# EAGLE design SchematicControlMotor (EAGLE 9.6.2)
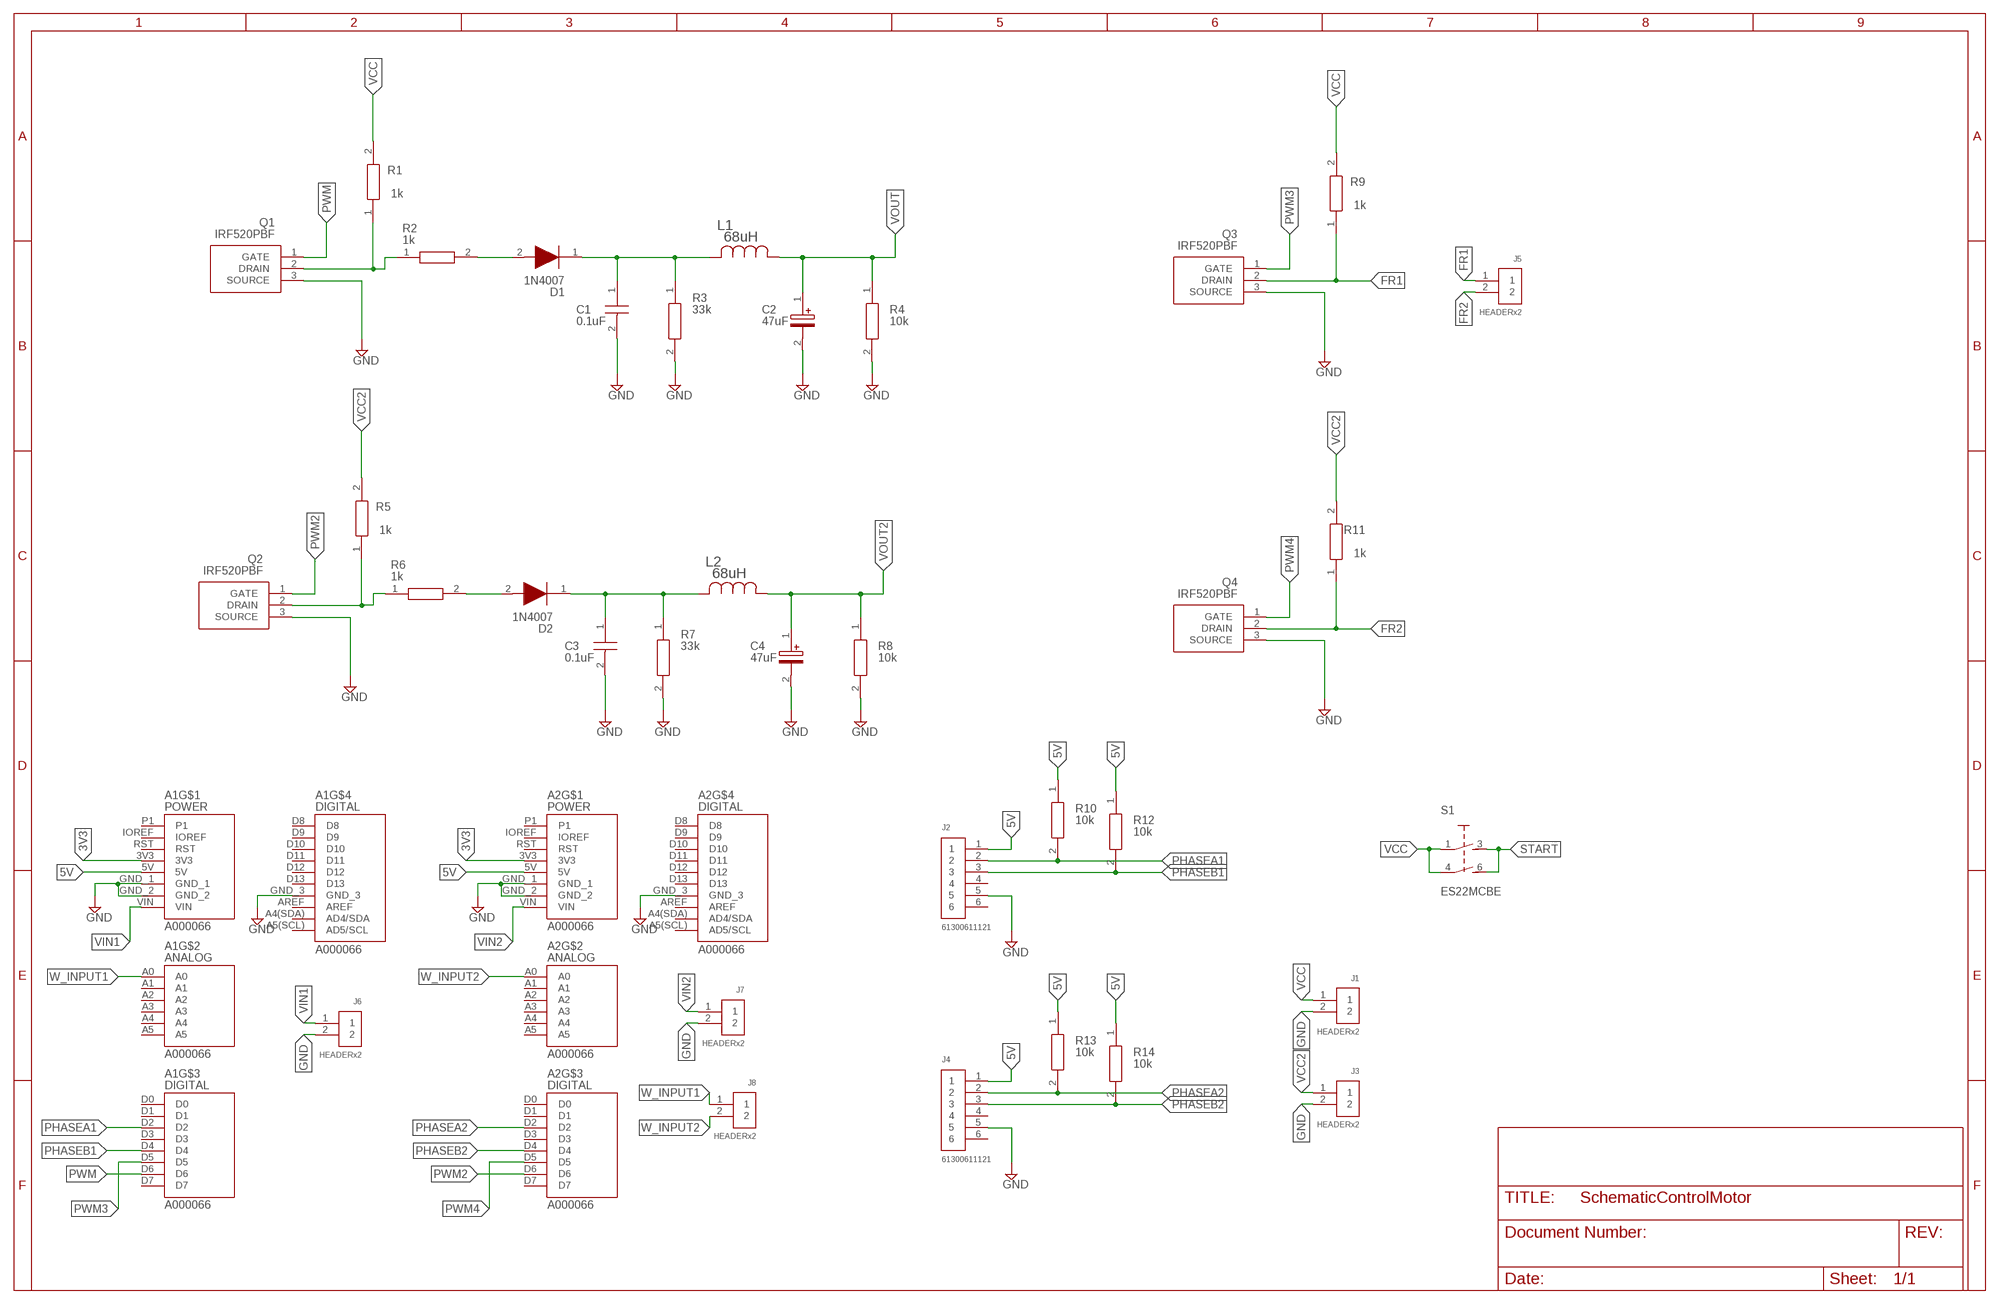
[diagram p0: schematic, sheet 1]

## Parts
A1  A000066  [ARDUINO_A000066]
A2  A000066  [ARDUINO_A000066]
C1  0.1uF  CAPACITOR0.1U  [K104K10X7RF5TL2]
C2  47uF  CAPACITOR10U  [CAPPRD200W50D525H1100]
C3  0.1uF  CAPACITOR0.1U  [K104K10X7RF5TL2]
C4  47uF  CAPACITOR10U  [CAPPRD200W50D525H1100]
D1  1N4007  [DIOAD1405W58L465D235]
D2  1N4007  [DIOAD1405W58L465D235]
J1  HEADERx2  61300211121  [61300211121]
J2  61300611121  [61300611121]
J3  HEADERx2  61300211121  [61300211121]
J4  61300611121  [61300611121]
J5  HEADERx2  61300211121  [61300211121]
J6  HEADERx2  61300211121  [61300211121]
J7  HEADERx2  61300211121  [61300211121]
J8  HEADERx2  61300211121  [61300211121]
L1  68uH  INDUCTOR68U  [IND_BOURNS_78F]
L2  68uH  INDUCTOR68U  [IND_BOURNS_78F]
Q1  IRF520PBF  [TO254P465X1024X2050-3P]
Q2  IRF520PBF  [TO254P465X1024X2050-3P]
Q3  IRF520PBF  [TO254P465X1024X2050-3P]
Q4  IRF520PBF  [TO254P465X1024X2050-3P]
R1  1k  RESISTOR  [RESAD1041W46L381D165]
R2  1k  RESISTOR  [RESAD1041W46L381D165]
R3  33k  RESISTOR  [RESAD1041W46L381D165]
R4  10k  RESISTOR  [RESAD1041W46L381D165]
R5  1k  RESISTOR  [RESAD1041W46L381D165]
R6  1k  RESISTOR  [RESAD1041W46L381D165]
R7  33k  RESISTOR  [RESAD1041W46L381D165]
R8  10k  RESISTOR  [RESAD1041W46L381D165]
R9  1k  RESISTOR  [RESAD1041W46L381D165]
R10  10k  RESISTOR  [RESAD1041W46L381D165]
R11  1k  RESISTOR  [RESAD1041W46L381D165]
R12  10k  RESISTOR  [RESAD1041W46L381D165]
R13  10k  RESISTOR  [RESAD1041W46L381D165]
R14  10k  RESISTOR  [RESAD1041W46L381D165]
S1  ES22MCBE  [ES22MCBE]

## Nets
3V3: A1.3V3 A2.3V3
5V: A1.5V A2.5V J2.1 J4.1 R10.1 R12.1 R13.1 R14.1
FR1: J5.1 Q3.2(DRAIN) R9.1
FR2: J5.2 Q4.2(DRAIN) R11.1
GND: A1.GND_1 A1.GND_2 A1.GND_3 A2.GND_1 A2.GND_2 A2.GND_3 C1.2 C2.2(-) C3.2 C4.2(-) J1.2 J2.5 J3.2 J4.5 J6.2 J7.2 Q1.3(SOURCE) Q2.3(SOURCE) Q3.3(SOURCE) Q4.3(SOURCE) R3.2 R4.2 R7.2 R8.2
N$1: Q1.2(DRAIN) R1.1 R2.1
N$2: D1.2(A) R2.2
N$3: C1.1 D1.1(K) L1.2 R3.1
N$4: D2.2(A) R6.2
N$5: C3.1 D2.1(K) L2.2 R7.1
N$6: Q2.2(DRAIN) R5.1 R6.1
PHASEA1: A1.D2 J2.2 R10.2
PHASEA2: A2.D2 J4.2 R13.2
PHASEB1: A1.D4 J2.3 R12.2
PHASEB2: A2.D4 J4.3 R14.2
PWM: A1.D6 Q1.1(GATE)
PWM2: A2.D6 Q2.1(GATE)
PWM3: A1.D5 Q3.1(GATE)
PWM4: A2.D5 Q4.1(GATE)
START: S1.3 S1.6
VCC: J1.1 R1.2 R9.2 S1.1 S1.4
VCC2: J3.1 R5.2 R11.2
VIN1: A1.VIN J6.1
VIN2: A2.VIN J7.1
VOUT: C2.1(+) L1.1 R4.1
VOUT2: C4.1(+) L2.1 R8.1
W_INPUT1: A1.A0 J8.1
W_INPUT2: A2.A0 J8.2
Unconnected: A1.A1 A1.A2 A1.A3 A1.A4 A1.A4(SDA)(AD4/SDA) A1.A5 A1.A5(SCL)(AD5/SCL) A1.AREF A1.D0 A1.D1 A1.D3 A1.D7 A1.D8 A1.D9 A1.D10 A1.D11 A1.D12 A1.D13 A1.IOREF A1.P1 A1.RST A2.A1 A2.A2 A2.A3 A2.A4 A2.A4(SDA)(AD4/SDA) A2.A5 A2.A5(SCL)(AD5/SCL) A2.AREF A2.D0 A2.D1 A2.D3 A2.D7 A2.D8 A2.D9 A2.D10 A2.D11 A2.D12 A2.D13 A2.IOREF A2.P1 A2.RST J2.4 J2.6 J4.4 J4.6

## Library data of the parts
A1 A2 = DisenoElectronico:A000066: Microcontroller board, Uno [Arduino] A000066 Microcontroller board, Uno 7640152110092 Check prices <https://pricing.snapeda.com/parts/A000066/Arduino/view-part?ref=eda> Check prices <https://pricing.snapeda.com/parts/A000066/Arduino/view-part?ref=eda> Check availability <https://pricing.snapeda.com/parts/ARDUINO%20UNO%20REV3/Arduino/view-part?ref=eda>; AVAILABILITY: Not in stock; DESCRIPTION: Microcontroller board based on the ATmega328P.; MF: Arduino; MP: ARDUINO UNO REV3; PACKAGE: Non-Standard Arduino; PRICE: None
C1 C3 = HardwareRobotica:CAPACITOR0.1U: Cap Ceramic 0.1uF 50V X7R 10% Radial 2.5mm 125C T/R Source: Datasheet <https://www.vishay.com/docs/45171/kseries.pdf>; DESCRIPTION: Cap Ceramic 0.1uF 50V X7R 10% Radial 2.5mm 125C T/R; HEIGHT: 5.2mm; MANUFACTURER_NAME: Vishay; MANUFACTURER_PART_NUMBER: K104K10X7RF5TL2; MOUSER_PART_NUMBER: 594-K104K10X7RF5TL2; MOUSER_PRICE-STOCK: https://www.mouser.co.uk/ProductDetail/Vishay-BC-Components/K104K10X7RF5TL2?qs=B4Lc6Tv24tbCh1UvC16VNg%3D%3D
C2 C4 = HardwareRobotica:CAPACITOR10U: CORNELL DUBILIER - SEK100M050ST - ALUMINUM ELECTROLYTIC CAPACITOR 10UF, 50V, 20%, RADIAL Source: Datasheet <https://componentsearchengine.com/Datasheets/2/SEK100M050ST.pdf>; DESCRIPTION: CORNELL DUBILIER - SEK100M050ST - ALUMINUM ELECTROLYTIC CAPACITOR 10UF, 50V, 20%, RADIAL; HEIGHT: 11mm; MANUFACTURER_NAME: Cornell Dubilier; MANUFACTURER_PART_NUMBER: SEK100M050ST; MOUSER_PART_NUMBER: 539-SEK50V10; MOUSER_PRICE-STOCK: https://www.mouser.co.uk/ProductDetail/Cornell-Dubilier-CDE/SEK100M050ST?qs=SToNfkNuIf70OBUI1whdlA%3D%3D
D1 D2 = HardwareRobotica:1N4007: Switching diode with a peak reverse voltage of 1 kV, a maximum forward current of 1 A, and a peak repetitive forward current of 5.4 A Source: Datasheet <https://diotec.com/tl_files/diotec/files/pdf/datasheets/1n4001.pdf>; DESCRIPTION: Switching diode with a peak reverse voltage of 1 kV, a maximum forward current of 1 A, and a peak repetitive forward current of 5.4 A; HEIGHT: mm; MANUFACTURER_NAME: Diotec; MANUFACTURER_PART_NUMBER: 1N4007; MOUSER_PART_NUMBER: 637-1N4007; MOUSER_PRICE-STOCK: https://www.mouser.co.uk/ProductDetail/Diotec-Semiconductor/1N4007?qs=OlC7AqGiEDmK9mU1uTiCkg%3D%3D
J1 J3 J5-J8 = Headers:61300211121: CONN HEADER VERT 2POS 2.54MM Manufacturer's datasheet <https://katalog.we-online.de/em/datasheet/6130xx11121.pdf>; CREATED_BY: PCBLayout.com; DIGI_KEY_PART_NUMBER: 732-5315-ND; MANUFACTURER: Wurth Electronics Inc.; MPN: 61300211121
J2 J4 = Headers:61300611121: CONN HEADER VERT 6POS 2.54MM Manufacturer's datasheet <https://katalog.we-online.de/em/datasheet/6130xx11121.pdf>; CREATED_BY: PCBLayout.com; DIGI_KEY_PART_NUMBER: 732-5319-ND; MANUFACTURER: Wurth Electronics Inc.; MPN: 61300611121
L1 L2 = HardwareRobotica:INDUCTOR68U; COPYRIGHT: Copyright (C) 2023 Ultra Librarian. All rights reserved.; DIGIKEY_PART_NUMBER_1: M10144-ND; MANUFACTURER_PART_NUMBER: 78F680J-RC; MFR_NAME: Bourns Electronics
Q1-Q4 = HardwareRobotica:IRF520PBF: TRANS MOSFET N-CH 100V 9.2A 3-PIN 3+TAB Vishay Siliconix IRF520PBF N-channel MOSFET Transistor, 9.2 A, 100 V, 3-Pin TO-220AB Source: Datasheet <https://datasheet.datasheetarchive.com/originals/distributors/Datasheets-DGA23/1583939.pdf>; DESCRIPTION: TRANS MOSFET N-CH 100V 9.2A 3-PIN 3+TAB Vishay Siliconix IRF520PBF N-channel MOSFET Transistor, 9.2 A, 100 V, 3-Pin TO-220AB; HEIGHT: 4.65mm; MANUFACTURER_NAME: Vishay; MANUFACTURER_PART_NUMBER: IRF520PBF; MOUSER_PART_NUMBER: 844-IRF520PBF; MOUSER_PRICE-STOCK: https://www.mouser.co.uk/ProductDetail/Vishay-Semiconductors/IRF520PBF?qs=%2FRKvNCQzLu0LFYQuStTxKg%3D%3D
R1-R14 = HardwareRobotica:RESISTOR: Vishay CMF50 Series ceramic Axial Metal Film Resistor 1k +/-1% 0.05W +/-50ppm/C Source: Datasheet <https://componentsearchengine.com/Datasheets/1/CMF501K0000FHEB.pdf>; DESCRIPTION: Vishay CMF50 Series ceramic Axial Metal Film Resistor 1k +/-1% 0.05W +/-50ppm/C; HEIGHT: mm; MANUFACTURER_NAME: Vishay; MANUFACTURER_PART_NUMBER: CMF501K0000FHEB; MOUSER_PART_NUMBER: 71-CMF501K0000FHEB; MOUSER_PRICE-STOCK: https://www.mouser.co.uk/ProductDetail/Vishay-Dale/CMF501K0000FHEB?qs=gQQ%2FpDEpiRLqpORAHHXMbg%3D%3D
S1 = Switch:ES22MCBE: SWITCH SLIDE DPST 0.4VA 20V Manufacturer's datasheet <https://www.ckswitches.com/media/1421/es.pdf>; CREATED_BY: PCBLayout.com; DIGIKEY_PARTNO: CKN1815-ND; MANUFACTURER: C&K; MPN: ES22MCBE

## Board
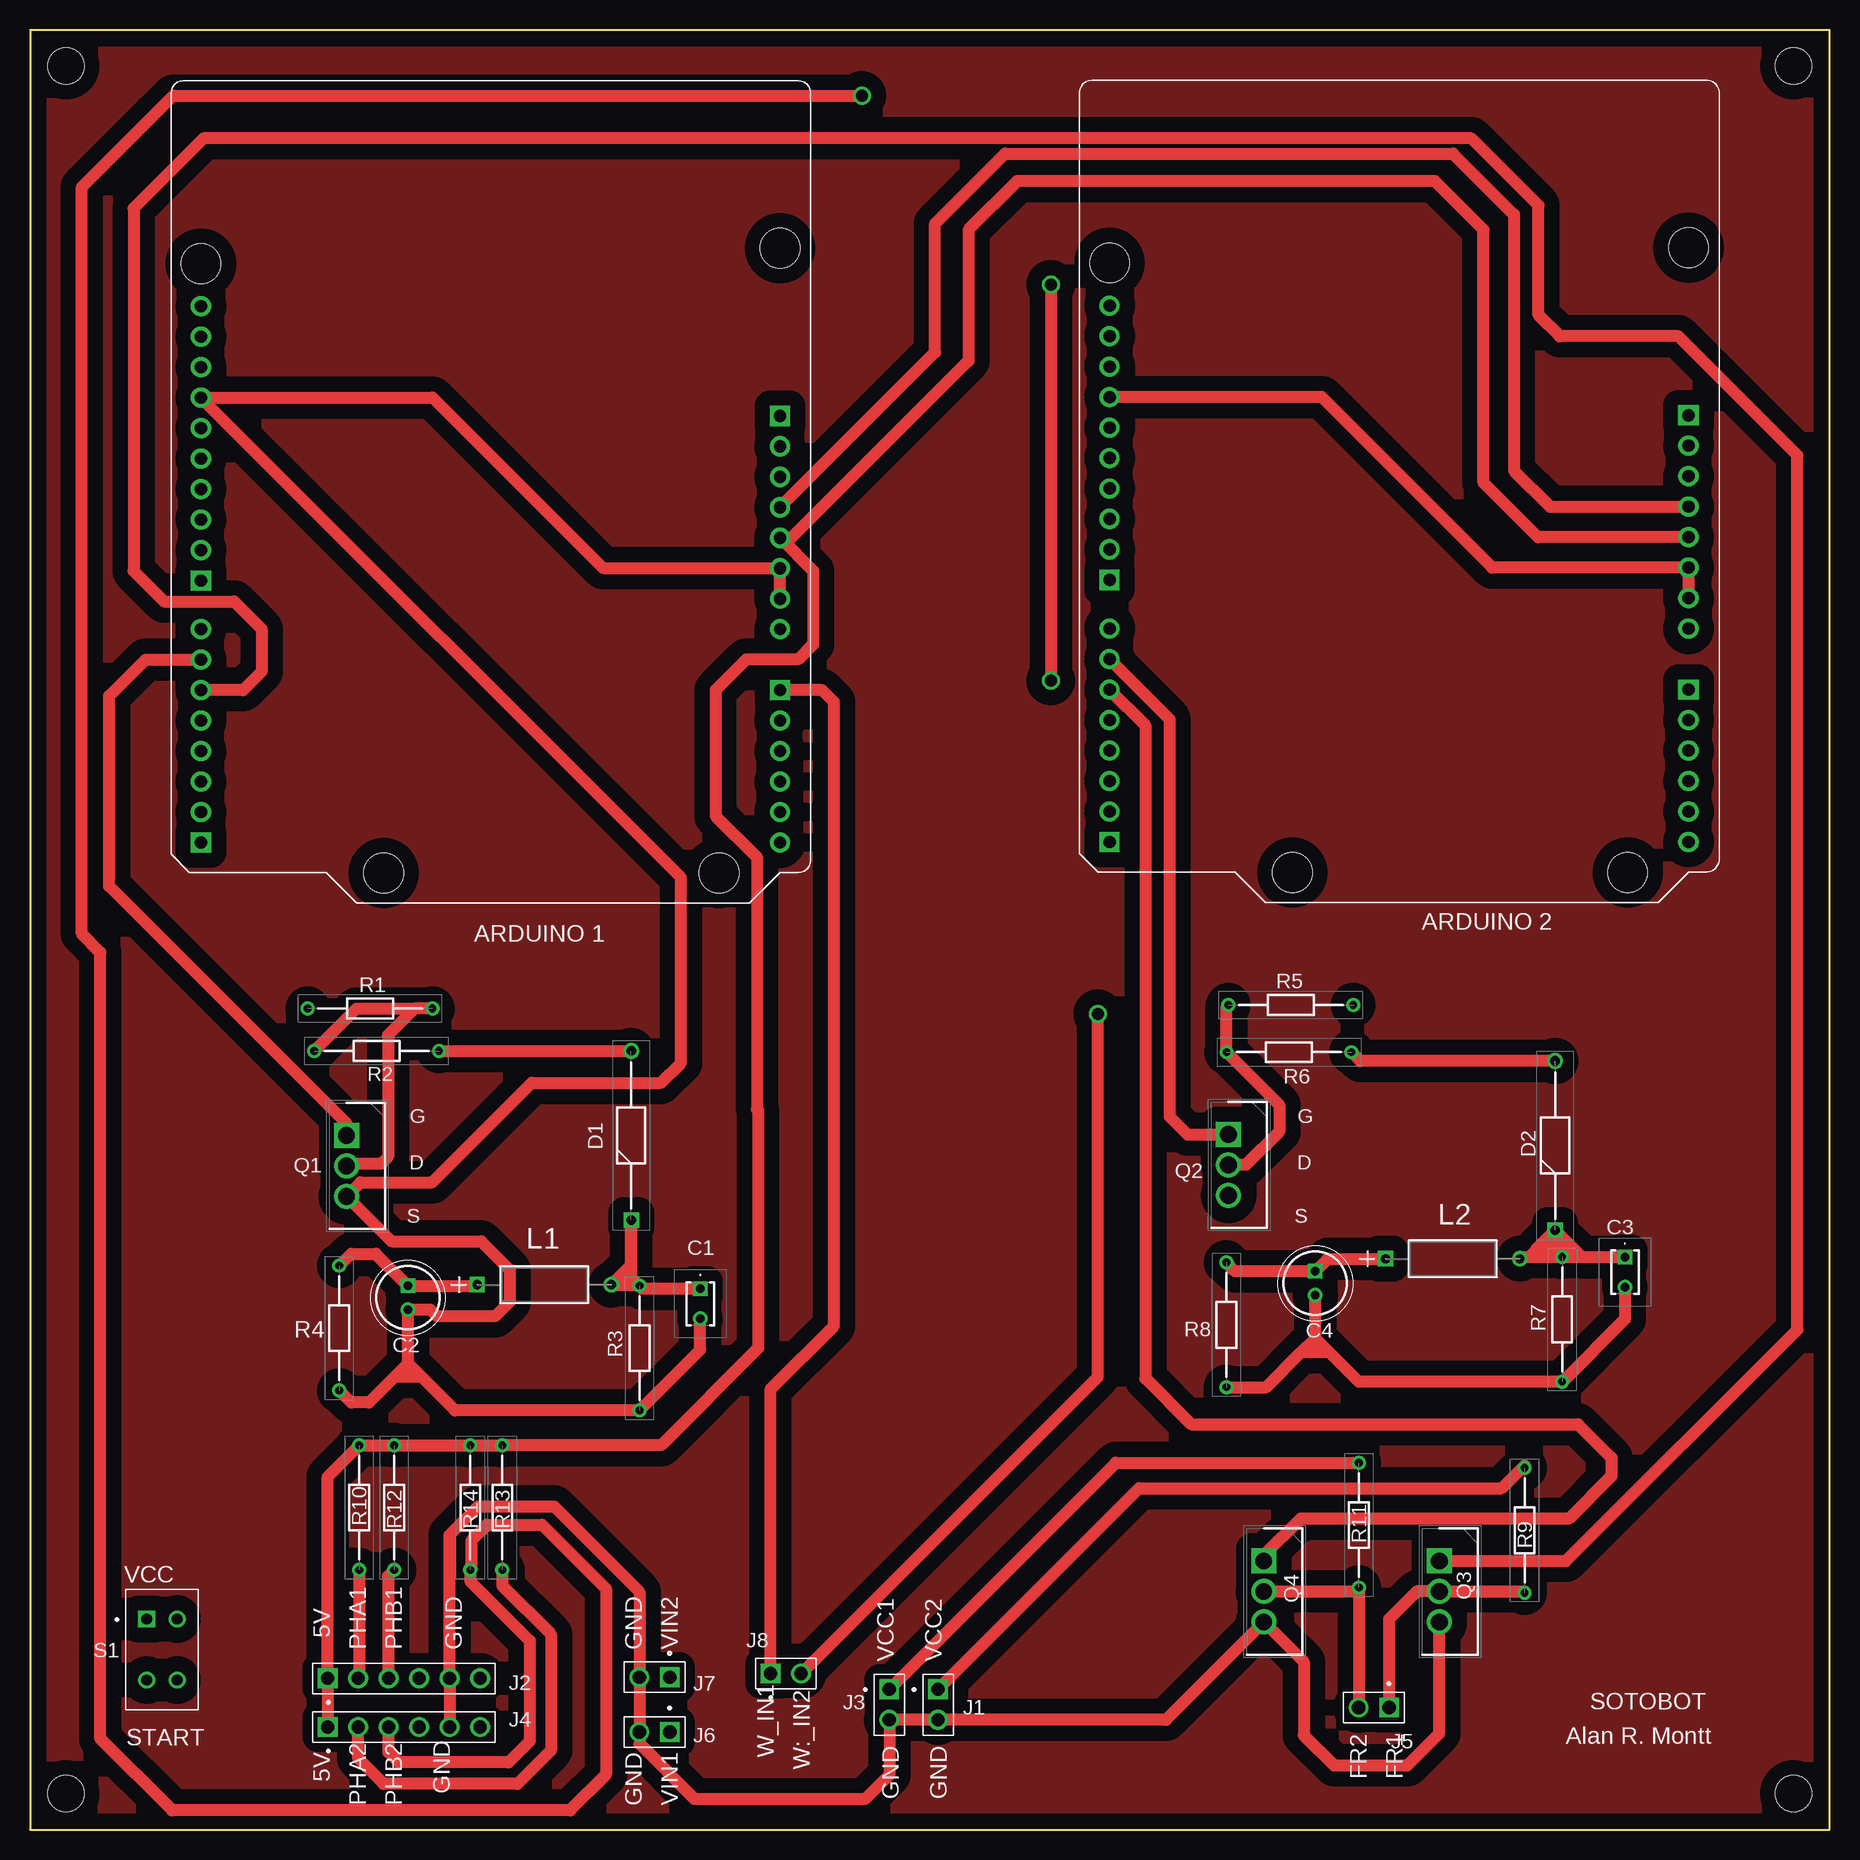
[diagram p1: board, top side]
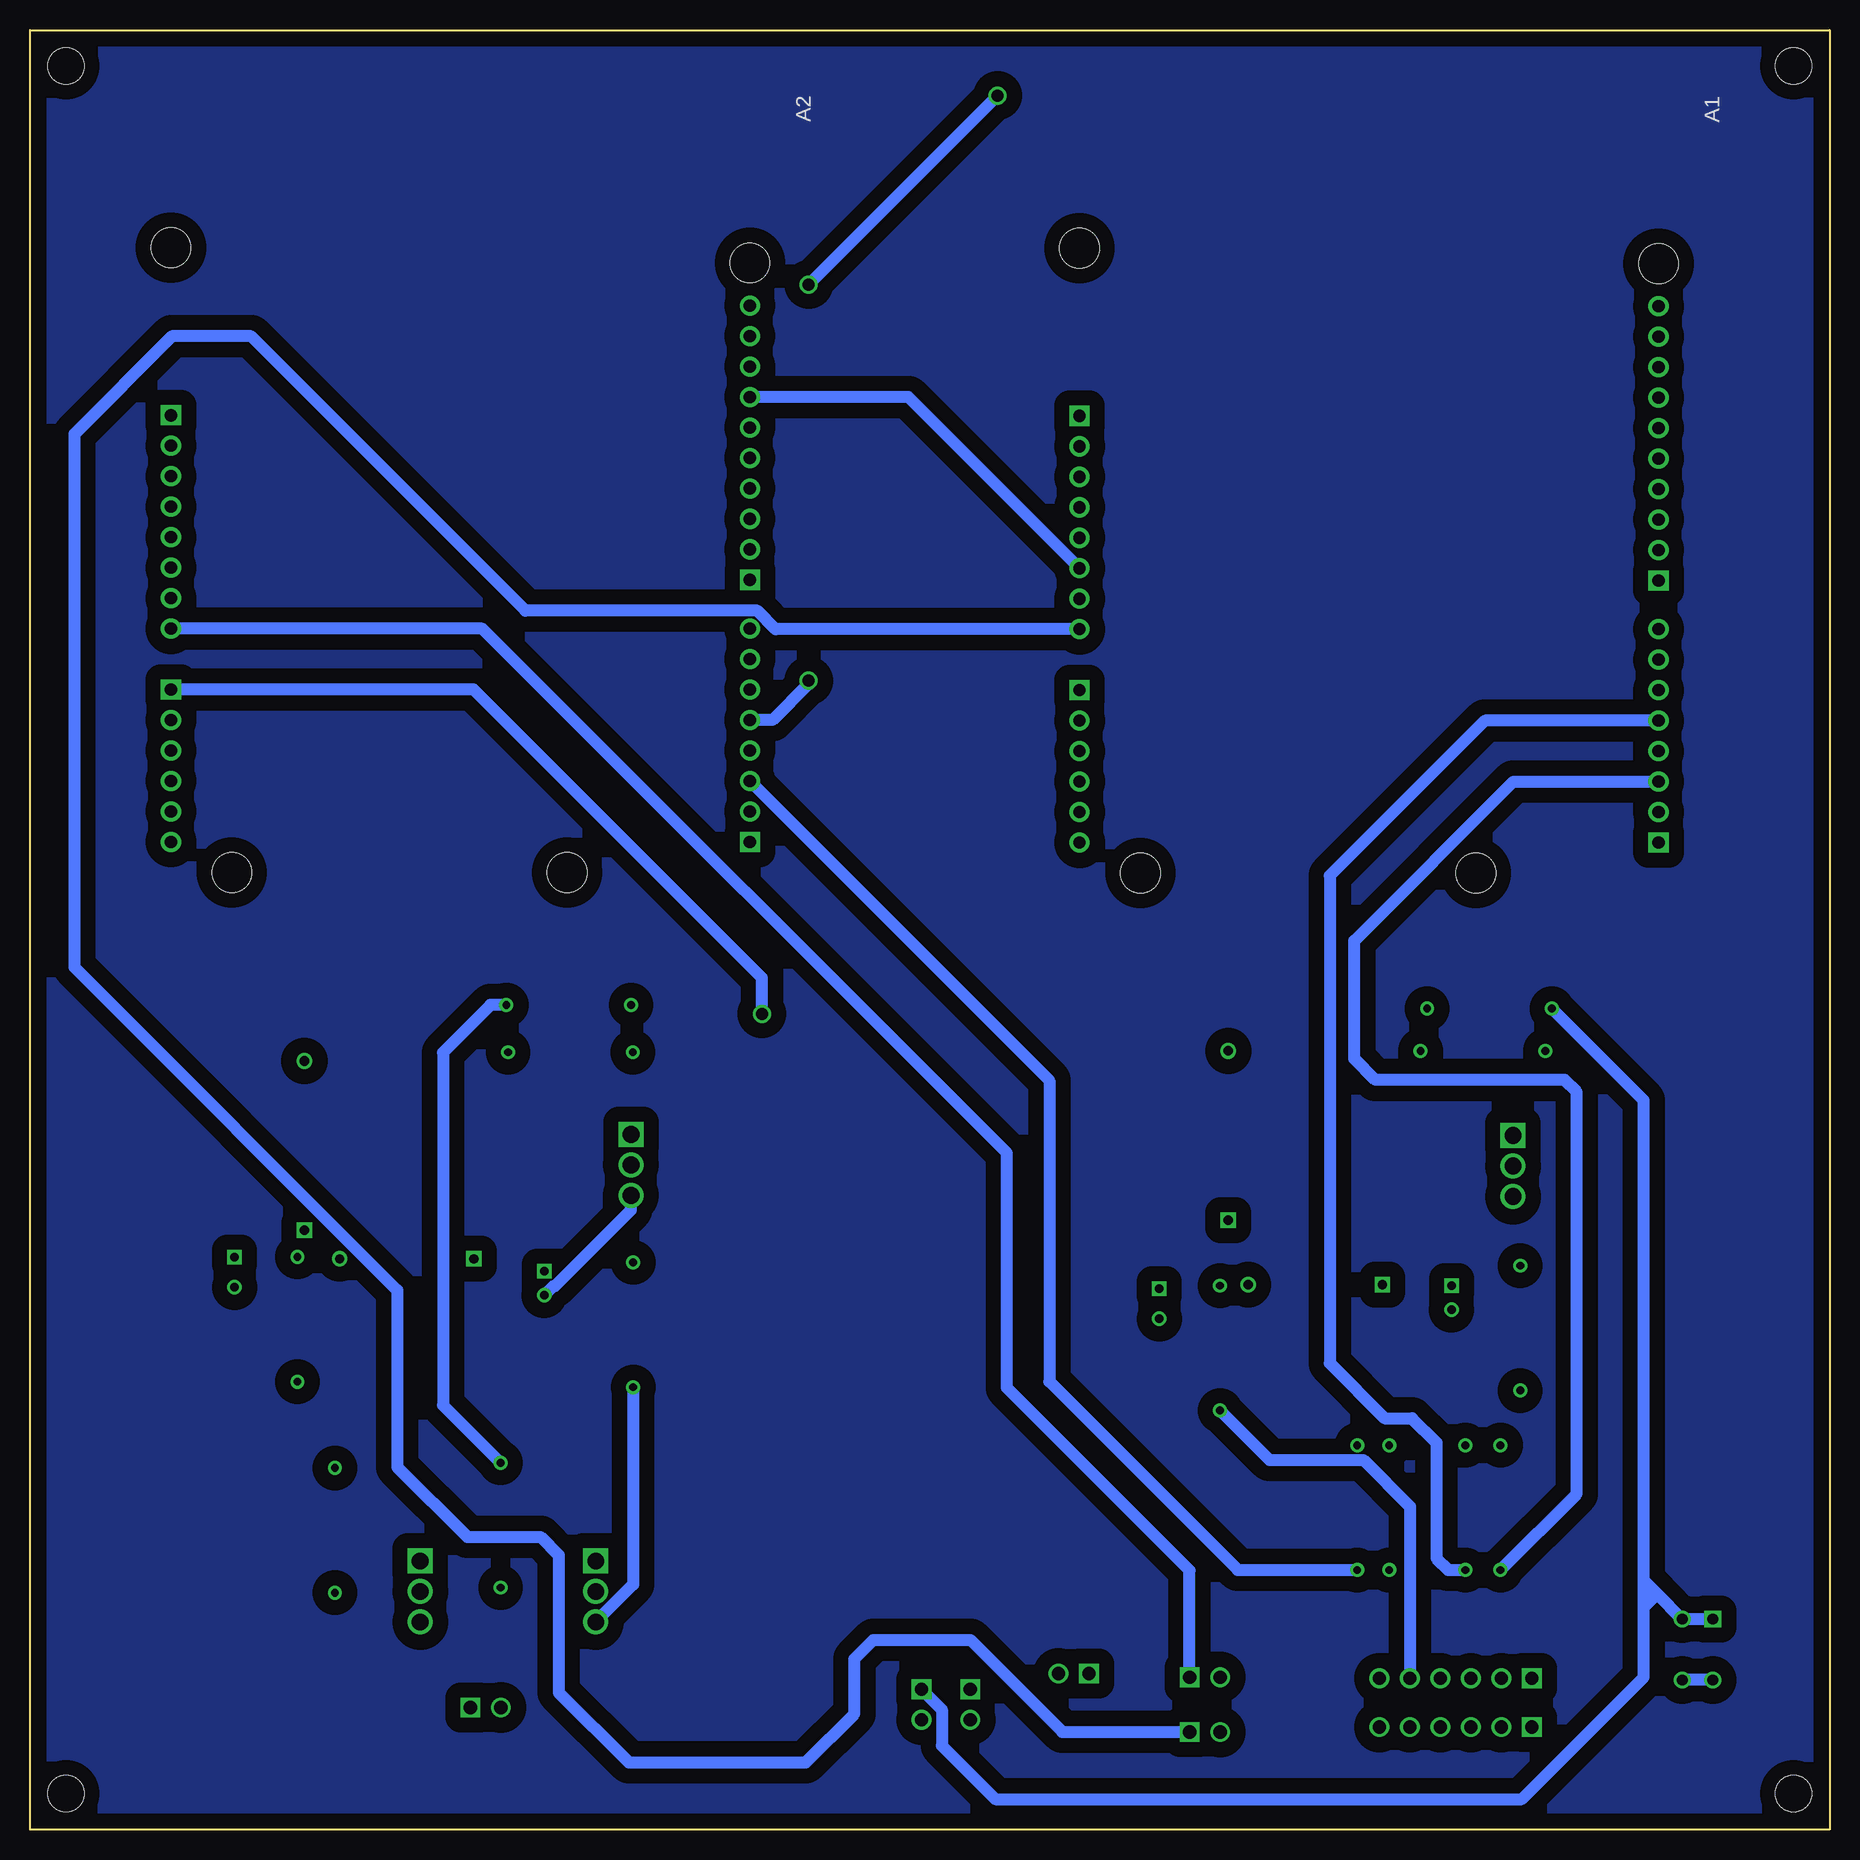
[diagram p2: board, bottom side, seen from below]

Size 150 x 150 mm. Coordinates in mm from the lower left corner, seen from the top.
Outline: 0,0 150,0 150,150 0,150 0,0
Copper layers (1*16): Top 0.035mm / dielectric 1.5mm / Bottom 0.035mm
Design rules "default": minimum track width 6mil, minimum drill 0.35mm, track to track 6mil, track to pad 6mil, pad to pad 6mil, via to via 6mil, smd to smd 6mil, copper to edge 40mil, drill to drill 6mil, minimum pad ring 10mil, minimum via ring 8mil, stop-mask expansion 4mil, vias tented up to drill 0mil, thermal gap 10mil
Holes 3 mm at 3,3 147,3 147,147 3,147

### Footprints (pad centres in the part's own frame; a part is rotated, then mirrored left to right if it is on the bottom)
ARDUINO_A000066 = drill 1.016 pad 1.676: 3V3 35.56,2.54; 5V 38.1,2.54; A1 53.34,2.54; A2 55.88,2.54; A3 58.42,2.54; A4 60.96,2.54; A4(SDA) 21.336,50.8; A5 63.5,2.54; A5(SCL) 18.796,50.8; AREF 23.876,50.8; D1 60.96,50.8; D2 58.42,50.8; D3 55.88,50.8; D4 53.34,50.8; D5 50.8,50.8; D6 48.26,50.8; D7 45.72,50.8; D9 39.116,50.8; D10 36.576,50.8; D11 34.036,50.8; D12 31.496,50.8; D13 28.956,50.8; GND_1 43.18,2.54; GND_2 40.64,2.54; GND_3 26.416,50.8; IOREF 30.48,2.54; RST 33.02,2.54; VIN 45.72,2.54 | drill 1.016 pad 1.676 square: A0 50.8,2.54; D0 63.5,50.8; D8 41.656,50.8; P1 27.94,2.54 | hole 3.3: 66.04,35.56; 66.04,7.62; 15.24,50.8; 13.97,2.54
K104K10X7RF5TL2 = drill 0.7 pad 1.2 square: 1 0,0 | drill 0.7 pad 1.2: 2 2.5,0
CAPPRD200W50D525H1100 = drill 0.7 pad 1.1 square: 1 0,0 | drill 0.7 pad 1.1: 2 2,0
DIOAD1405W58L465D235 = drill 0.8 pad 1.2 square: 1 0,0 | drill 0.8 pad 1.2: 2 14.1,0
61300211121 = drill 1.1 square: 1 -1.27,0 | drill 1.1: 2 1.27,0
61300611121 = drill 1.1 square: 1 -6.35,0 | drill 1.1: 2 -3.81,0; 3 -1.27,0; 4 1.27,0; 5 3.81,0; 6 6.35,0
IND_BOURNS_78F = drill 0.762 pad 1.27 square: 1 0,0 | drill 0.762 pad 1.27: 2 11.176,0
TO254P465X1024X2050-3P = drill 1.39 pad 2.085 square: 1 0,0 | drill 1.39 pad 2.085: 2 2.54,0; 3 5.08,0
RESAD1041W46L381D165 = drill 0.65 pad 1.05: 1 0,0; 2 10.4,0
ES22MCBE = drill 0.89 square: 1 -1.27,2.54 | drill 0.89: 3 -1.27,-2.54; 4 1.27,2.54; 6 1.27,-2.54

### Placement (x,y rotation side)
A1  65.05,145.77 270 bottom
A2  140.79,145.82 270 bottom
C1  55.87,45.07 270 top
C2  31.51,45.32 270 top
C3  132.94,47.7 270 top
C4  107.14,46.53 270 top
D1  50.11,50.8 90 top
D2  127.13,49.96 90 top
J1  75.69,10.41 270 top
J2  31.17,12.6 0 top
J3  71.63,10.41 270 top
J4  31.17,8.53 0 top
J5  112.01,10.16 180 top
J6  52.07,8.13 180 top
J7  52.07,12.7 180 top
J8  63,13 0 top
L1  37.28,45.41 0 top
L2  113,47.57 0 top
Q1  26.39,57.85 270 top
Q2  99.9,57.94 270 top
Q3  117.47,22.38 270 top
Q4  102.84,22.38 270 top
R1  33.55,68.43 180 top
R2  23.69,64.9 0 top
R3  50.8,45.33 270 top
R4  25.78,47 270 top
R5  99.9,68.73 0 top
R6  99.75,64.8 0 top
R7  127.71,47.73 270 top
R8  99.72,47.27 270 top
R9  124.59,19.74 90 top
R10  27.43,32.03 270 top
R11  110.77,20.17 90 top
R12  30.35,32.03 270 top
R13  39.37,32.03 270 top
R14  36.7,32.03 270 top
S1  11,15 0 top

### Tracks (layer width: path | path; a pad name or v marks a point on that pad's centre or on a via)
3V3
  Top 1: A1.3V3 75.44,123.14 75.44,133.86 81.28,139.7 118.62,139.7 123.7,134.62 123.7,113.28 126.72,110.26 A2.3V3
5V
  Top 1: A2.5V 125.7,107.72 121.16,112.27 121.16,133.35 117.09,137.41 82.3,137.41 78.23,133.35 78.23,122.43 63.48,107.67 A1.5V 65.28,104.9 65.28,98.81 64.01,97.54 59.69,97.54 57.15,95 57.15,84.49 60.59,81.04 60.59,60.05 60.71,59.94 60.71,40.13 52.6,32.03 R13.1 R14.1 R12.1 R10.1 24.82,29.41 J2.1 J4.1
BOT
  pour Bottom (isolate 1.27, no thermals): 0,0 150,0 150,150 0,150
FR1
  Top 1: R9.1 124.48,19.84 Q3.2 115.59,19.84 113.28,17.53 J5.1
FR2
  Top 1: Q4.2 110.44,19.84 R11.1 110.77,10.19 J5.2
GND
  Top 1: R4.2 26.78,35.6 28.25,35.6 30.38,37.72 | 31.51,38.85 30.38,37.72 | 31.51,38.85 C2.2 33.39,43.32 33.93,42.77 38.76,42.77 39.98,43.99 39.98,46.66 37.62,49.02 30.13,49.02 Q1.3 27.56,53.94 33.53,53.94 41.82,62.23 52.58,62.23 54.26,63.91 54.26,79.34 A1.GND_3 33.55,119.36 47.75,105.16 62.48,105.16 A1.GND_2 A1.GND_1 | C1.2 55.87,40 R3.2 35.43,34.93 32.64,37.72 | 32.64,37.72 31.51,38.85 | 107.14,40.95 C4.2 | 108.33,39.75 110.75,37.33 R7.2 132.94,42.56 C3.2 | 108.33,39.75 107.14,40.95 | 32.64,37.72 30.38,37.72 | R8.2 103.06,36.87 105.94,39.75 | 105.94,39.75 107.14,40.95 | 108.33,39.75 105.94,39.75 | A2.GND_3 107.67,119.41 121.89,105.18 A2.GND_2 A2.GND_1 | J4.5 J2.5 34.98,24.56 37.34,26.92 43.69,26.92 50.8,19.81 J7.2 J6.2 50.8,7.13 55.39,2.54 69.6,2.54 71.63,4.57 J3.2 J1.2 94.69,9.14 Q4.3 106.17,13.97 106.17,7.87 108.71,5.33 114.81,5.33 117.47,8 Q3.3
  Bottom 1: R3.2 46.67,30.8 38.86,30.8 34.98,26.91 J2.5 | A1.GND_2 76.78,119.41 A2.GND_3 | R8.2 99.72,20.42 Q4.3 | C4.2 106.39,45.28 106.26,45.28 99.9,51.64 Q2.3
N$1
  Top 1: R1.1 32.05,68.43 | 32.05,68.43 29.84,66.22 29.84,56.07 29.26,55.49 26.57,55.49 Q1.2 | R2.1 27.21,68.43 32.05,68.43
N$2
  Top 1: R2.2 49.95,64.91 D1.2
N$3
  Top 1: C1.1 51.06,45.07 R3.1 | R3.1 50.11,46.02 D1.1 50.11,47.07 L1.2 50.72,45.41 R3.1
N$4
  Top 1: D2.2 110.88,64.06 R6.2
N$5
  Top 1: L2.2 124.33,47.73 124.97,47.73 | 124.97,47.73 R7.1 | R7.1 132.92,47.73 C3.1 129.39,47.7 128.04,49.05 | 128.04,49.05 D2.1 | R7.1 127.13,48.31 | 127.13,48.31 D2.1 | R7.1 127.71,48.72 128.04,49.05 | 124.97,47.73 125.55,48.31 | 127.13,48.31 125.55,48.31 | 125.55,48.31 125.55,48.39 D2.1
N$6
  Top 1: R5.1 99.75,68.58 R6.1 104.14,60.4 104.14,58.17 101.37,55.4 Q2.2
PHASEA1
  Top 1: R10.2 27.43,12.68 J2.2
  Bottom 1: R10.2 21.08,27.98 21.08,61.47 22.1,62.48 37.85,62.48 39.62,64.26 39.62,74.07 26.35,87.35 A1.D2
PHASEA2
  Top 1: R13.2 39.37,20.32 43.43,16.26 43.43,6.6 40.64,3.81 29.46,3.81 27.36,5.92 J4.2
  Bottom 1: A2.D2 65.02,62.43 65.02,37.34 49.31,21.63 R13.2
PHASEB1
  Top 1: R12.2 29.84,21.12 29.84,12.65 J2.3
  Bottom 1: A1.D4 28.73,92.43 41.66,79.5 41.66,38.86 37.08,34.29 34.8,34.29 32.77,32.26 32.77,22.61 31.79,21.63 R12.2
PHASEB2  (via drill 1)
  Top 1: J4.3 29.9,6.43 30.73,5.59 39.88,5.59 41.66,7.37 41.66,15.75 36.7,20.7 R14.2 36.83,21.76 36.83,24.13 38.1,25.4 42.67,25.4 48.01,20.07 48.01,4.57 45.03,1.59 11.84,1.59 5.87,7.56 5.87,73.12 4.32,74.68 4.32,136.91 11.94,144.53 v69.34,144.53 | v85.09,128.78 v85.09,95.76
  Bottom 1: v69.34,144.53 v85.09,128.78 | v85.09,95.76 85.09,95.5 88.11,92.48 A2.D4
PWM
  Top 1: Q1.1 26.39,58.85 6.6,78.63 6.6,94.49 9.63,97.51 A1.D6
PWM2
  Top 1: A2.D6 95,92.56 95,59.44 96.5,57.94 Q2.1
PWM3
  Top 1: Q3.1 128.04,22.38 147.32,41.66 147.32,114.55 137.41,124.46 127.51,124.46 125.73,126.24 125.73,135.38 120.14,140.97 14.48,140.97 8.64,135.13 8.64,104.9 11.18,102.36 17.02,102.36 19.3,100.08 19.3,96.52 17.75,94.97 A1.D5
PWM4
  Top 1: A2.D5 92.96,92.05 92.96,37.59 96.77,33.78 129.03,33.78 131.83,30.99 131.83,29.46 128.27,25.91 105.92,25.91 102.84,22.84 Q4.1
START
  Bottom 1: S1.3 S1.6
TOP
  pour Top (isolate 1.27, no thermals): 0,0 150,0 150,150 0,150
VCC
  Top 1: R9.2 124.59,30.35 122.68,28.45 92.46,28.45 J1.1
  Bottom 1: R1.2 15.49,60.78 15.49,20.76 | 15.49,18.51 15.49,12.7 25.65,2.54 69.54,2.54 74,7 74,9.99 J1.1 | 15.49,18.51 15.49,20.76 | S1.1 S1.4 14.37,19.64 | 14.37,19.64 15.49,20.76 | 14.37,19.64 15.49,18.51
VCC2
  Top 1: J3.1 90.51,30.57 R11.2
  Bottom 1: R5.2 111.61,68.73 115.57,64.77 115.57,35.37 R11.2
VIN1
  Bottom 1: A1.VIN 87.83,100.05 89.38,101.59 108.7,101.59 131.57,124.46 138.18,124.46 146.3,116.33 146.3,71.88 119.38,44.96 119.38,30.23 113.54,24.38 107.44,24.38 105.92,22.86 105.92,11.43 100.08,5.59 85.34,5.59 81.28,9.65 81.28,14.22 79.71,15.8 71.61,15.8 63.94,8.13 J6.1
VIN2
  Bottom 1: J7.1 53.34,21.59 68.58,36.83 68.58,56.39 112.29,100.1 A2.VIN
VOUT
  Top 1: L1.1 37.28,45.32 C2.1 28.83,48 26.78,48 R4.1
VOUT2
  Top 1: L2.1 108.18,47.57 C4.1 100.46,46.53 R8.1
W_INPUT1
  Top 1: J8.1 61.73,36.73 67,42 67,94 66.03,94.97 A1.A0
W_INPUT2  (via drill 1)
  Top 1: J8.2 89,37.73 v89,68
  Bottom 1: v89,68 89,71 113.02,95.02 A2.A0

### Text on the board
tPlace: ARDUINO 2 | ARDUINO 1 | R2 | G | G | D | D | S | S | L2 | L1 | R4 | VCC | 5V | PHA1 | PHB1 | GND | GND | VIN2 | VCC1 | VCC2 | SOTOBOT | FR2 | FR1 | START | GND | GND | W_IN1 | W:_IN2 | Alan R. Montt | 5V | GND | PHA2 | PHB2 | GND | VIN1